# Altium schematic sheet 3_SDRAM_Memories.SchDoc
size A4; Organization: SpaceLab UFSC; Address1: UFSC - SpaceLab; Address2: University Campus - Trindade; Address3: Dep. of Electrical Engineering - CTC; Address4: Florianópolis, Santa Catarina, Brazil; Address5: CEP: 88040 - 900
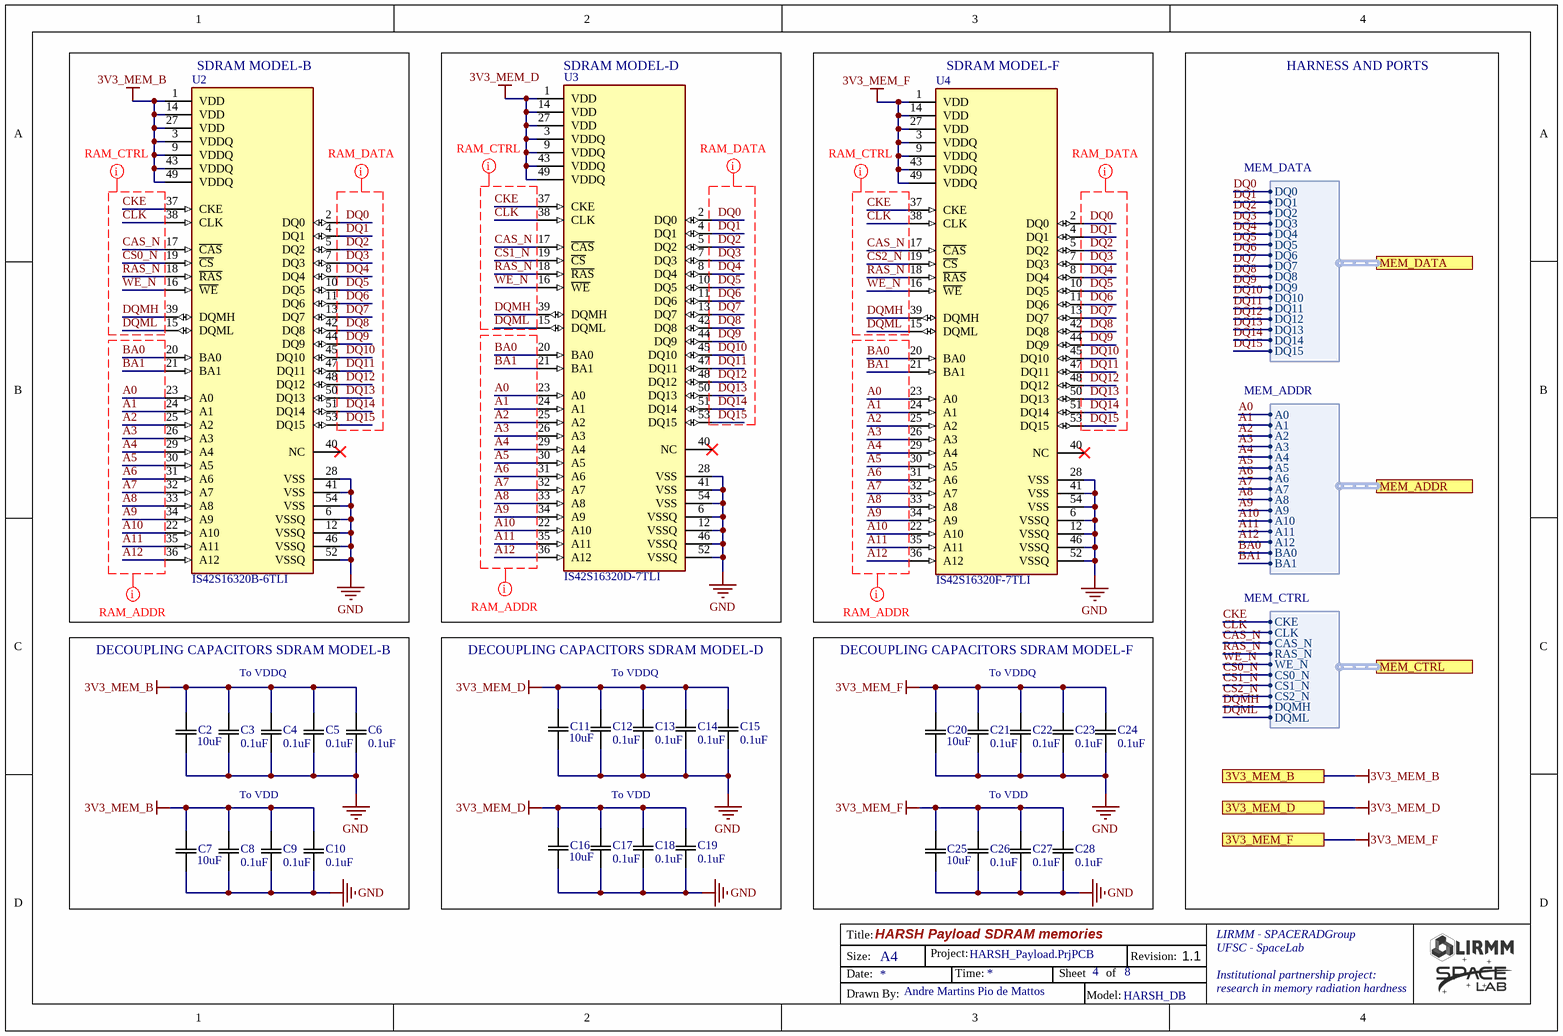
[diagram p0: 3_SDRAM_Memories.SchDoc]

## Parts
C2  10uF  [DONE_C0603]
C3  Capacitance: 0.1uF  [DONE_C0603]  (hidden comment: 100nF/50V)
C4  Capacitance: 0.1uF  [DONE_C0603]  (hidden comment: 100nF/50V)
C5  Capacitance: 0.1uF  [DONE_C0603]  (hidden comment: 100nF/50V)
C6  Capacitance: 0.1uF  [DONE_C0603]  (hidden comment: 100nF/50V)
C7  10uF  [DONE_C0603]
C8  Capacitance: 0.1uF  [DONE_C0603]  (hidden comment: 100nF/50V)
C9  Capacitance: 0.1uF  [DONE_C0603]  (hidden comment: 100nF/50V)
C10  Capacitance: 0.1uF  [DONE_C0603]  (hidden comment: 100nF/50V)
C11  10uF  [DONE_C0603]
C12  Capacitance: 0.1uF  [DONE_C0603]  (hidden comment: 100nF/50V)
C13  Capacitance: 0.1uF  [DONE_C0603]  (hidden comment: 100nF/50V)
C14  Capacitance: 0.1uF  [DONE_C0603]  (hidden comment: 100nF/50V)
C15  Capacitance: 0.1uF  [DONE_C0603]  (hidden comment: 100nF/50V)
C16  10uF  [DONE_C0603]
C17  Capacitance: 0.1uF  [DONE_C0603]  (hidden comment: 100nF/50V)
C18  Capacitance: 0.1uF  [DONE_C0603]  (hidden comment: 100nF/50V)
C19  Capacitance: 0.1uF  [DONE_C0603]  (hidden comment: 100nF/50V)
C20  10uF  [DONE_C0603]
C21  Capacitance: 0.1uF  [DONE_C0603]  (hidden comment: 100nF/50V)
C22  Capacitance: 0.1uF  [DONE_C0603]  (hidden comment: 100nF/50V)
C23  Capacitance: 0.1uF  [DONE_C0603]  (hidden comment: 100nF/50V)
C24  Capacitance: 0.1uF  [DONE_C0603]  (hidden comment: 100nF/50V)
C25  10uF  [DONE_C0603]
C26  Capacitance: 0.1uF  [DONE_C0603]  (hidden comment: 100nF/50V)
C27  Capacitance: 0.1uF  [DONE_C0603]  (hidden comment: 100nF/50V)
C28  Capacitance: 0.1uF  [DONE_C0603]  (hidden comment: 100nF/50V)
U2  IS42S16320B-6TLI  [DONE_ISSI_MEM_TSOP_54]
U3  IS42S16320D-7TLI  [DONE_ISSI_MEM_TSOP_54]
U4  IS42S16320F-7TLI  [DONE_ISSI_MEM_TSOP_54]

## Blocks framed on the sheet
SDRAM MODEL-B: U2
SDRAM MODEL-D: U3
SDRAM MODEL-F: U4
DECOUPLING CAPACITORS SDRAM MODEL-B: C2-C10
DECOUPLING CAPACITORS SDRAM MODEL-D: C11-C19
DECOUPLING CAPACITORS SDRAM MODEL-F: C20-C28

## Ports
3V3_MEM_B, 3V3_MEM_D, 3V3_MEM_F, MEM_ADDR (harness MEM_ADDR), MEM_CTRL (harness MEM_CTRL), MEM_DATA (harness MEM_DATA)

## Harnesses
MEM_DATA: DQ0, DQ1, DQ2, DQ3, DQ4, DQ5, DQ6, DQ7, DQ8, DQ9, DQ10, DQ11, DQ12, DQ13, DQ14, DQ15
MEM_ADDR: A0, A1, A2, A3, A4, A5, A6, A7, A8, A9, A10, A11, A12, BA0, BA1
MEM_CTRL: CKE, CLK, CAS_N, RAS_N, WE_N, CS0_N, CS1_N, CS2_N, DQMH, DQML

## Nets
3V3_MEM_B: C2.1 C3.1 C4.1 C5.1 C6.1 C7.1 C8.1 C9.1 C10.1 U2.1(VDD) U2.3(VDDQ) U2.9(VDDQ) U2.14(VDD) U2.27(VDD) U2.43(VDDQ) U2.49(VDDQ) ; port 3V3_MEM_B
3V3_MEM_D: C11.1 C12.1 C13.1 C14.1 C15.1 C16.1 C17.1 C18.1 C19.1 U3.1(VDD) U3.3(VDDQ) U3.9(VDDQ) U3.14(VDD) U3.27(VDD) U3.43(VDDQ) U3.49(VDDQ) ; port 3V3_MEM_D
3V3_MEM_F: C20.1 C21.1 C22.1 C23.1 C24.1 C25.1 C26.1 C27.1 C28.1 U4.1(VDD) U4.3(VDDQ) U4.9(VDDQ) U4.14(VDD) U4.27(VDD) U4.43(VDDQ) U4.49(VDDQ) ; port 3V3_MEM_F
GND: C2.2 C3.2 C4.2 C5.2 C6.2 C7.2 C8.2 C9.2 C10.2 C11.2 C12.2 C13.2 C14.2 C15.2 C16.2 C17.2 C18.2 C19.2 C20.2 C21.2 C22.2 C23.2 C24.2 C25.2 C26.2 C27.2 C28.2 U2.6(VSSQ) U2.12(VSSQ) U2.28(VSS) U2.41(VSS) U2.46(VSSQ) U2.52(VSSQ) U2.54(VSS) U3.6(VSSQ) U3.12(VSSQ) U3.28(VSS) U3.41(VSS) U3.46(VSSQ) U3.52(VSSQ) U3.54(VSS) U4.6(VSSQ) U4.12(VSSQ) U4.28(VSS) U4.41(VSS) U4.46(VSSQ) U4.52(VSSQ) U4.54(VSS)
A0: U2.23(A0) U3.23(A0) U4.23(A0) ; port MEM_ADDR.A0
A1: U2.24(A1) U3.24(A1) U4.24(A1) ; port MEM_ADDR.A1
A2: U2.25(A2) U3.25(A2) U4.25(A2) ; port MEM_ADDR.A2
A3: U2.26(A3) U3.26(A3) U4.26(A3) ; port MEM_ADDR.A3
A4: U2.29(A4) U3.29(A4) U4.29(A4) ; port MEM_ADDR.A4
A5: U2.30(A5) U3.30(A5) U4.30(A5) ; port MEM_ADDR.A5
A6: U2.31(A6) U3.31(A6) U4.31(A6) ; port MEM_ADDR.A6
A7: U2.32(A7) U3.32(A7) U4.32(A7) ; port MEM_ADDR.A7
A8: U2.33(A8) U3.33(A8) U4.33(A8) ; port MEM_ADDR.A8
A9: U2.34(A9) U3.34(A9) U4.34(A9) ; port MEM_ADDR.A9
A10: U2.22(A10) U3.22(A10) U4.22(A10) ; port MEM_ADDR.A10
A11: U2.35(A11) U3.35(A11) U4.35(A11) ; port MEM_ADDR.A11
A12: U2.36(A12) U3.36(A12) U4.36(A12) ; port MEM_ADDR.A12
BA0: U2.20(BA0) U3.20(BA0) U4.20(BA0) ; port MEM_ADDR.BA0
BA1: U2.21(BA1) U3.21(BA1) U4.21(BA1) ; port MEM_ADDR.BA1
CAS_N: U2.17(~{CAS}) U3.17(~{CAS}) U4.17(~{CAS}) ; port MEM_CTRL.CAS_N
CKE: U2.37(CKE) U3.37(CKE) U4.37(CKE) ; port MEM_CTRL.CKE
CLK: U2.38(CLK) U3.38(CLK) U4.38(CLK) ; port MEM_CTRL.CLK
CS0_N: U2.19(~{CS}) ; port MEM_CTRL.CS0_N
CS1_N: U3.19(~{CS}) ; port MEM_CTRL.CS1_N
CS2_N: U4.19(~{CS}) ; port MEM_CTRL.CS2_N
DQ0: U2.2(DQ0) U3.2(DQ0) U4.2(DQ0) ; port MEM_DATA.DQ0
DQ1: U2.4(DQ1) U3.4(DQ1) U4.4(DQ1) ; port MEM_DATA.DQ1
DQ2: U2.5(DQ2) U3.5(DQ2) U4.5(DQ2) ; port MEM_DATA.DQ2
DQ3: U2.7(DQ3) U3.7(DQ3) U4.7(DQ3) ; port MEM_DATA.DQ3
DQ4: U2.8(DQ4) U3.8(DQ4) U4.8(DQ4) ; port MEM_DATA.DQ4
DQ5: U2.10(DQ5) U3.10(DQ5) U4.10(DQ5) ; port MEM_DATA.DQ5
DQ6: U2.11(DQ6) U3.11(DQ6) U4.11(DQ6) ; port MEM_DATA.DQ6
DQ7: U2.13(DQ7) U3.13(DQ7) U4.13(DQ7) ; port MEM_DATA.DQ7
DQ8: U2.42(DQ8) U3.42(DQ8) U4.42(DQ8) ; port MEM_DATA.DQ8
DQ9: U2.44(DQ9) U3.44(DQ9) U4.44(DQ9) ; port MEM_DATA.DQ9
DQ10: U2.45(DQ10) U3.45(DQ10) U4.45(DQ10) ; port MEM_DATA.DQ10
DQ11: U2.47(DQ11) U3.47(DQ11) U4.47(DQ11) ; port MEM_DATA.DQ11
DQ12: U2.48(DQ12) U3.48(DQ12) U4.48(DQ12) ; port MEM_DATA.DQ12
DQ13: U2.50(DQ13) U3.50(DQ13) U4.50(DQ13) ; port MEM_DATA.DQ13
DQ14: U2.51(DQ14) U3.51(DQ14) U4.51(DQ14) ; port MEM_DATA.DQ14
DQ15: U2.53(DQ15) U3.53(DQ15) U4.53(DQ15) ; port MEM_DATA.DQ15
DQMH: U2.39(DQMH) U3.39(DQMH) U4.39(DQMH) ; port MEM_CTRL.DQMH
DQML: U2.15(DQML) U3.15(DQML) U4.15(DQML) ; port MEM_CTRL.DQML
RAS_N: U2.18(~{RAS}) U3.18(~{RAS}) U4.18(~{RAS}) ; port MEM_CTRL.RAS_N
WE_N: U2.16(~{WE}) U3.16(~{WE}) U4.16(~{WE}) ; port MEM_CTRL.WE_N

Not connected (* = marked no-connect by the designer): U2 40(NC)*; U3 40(NC)*; U4 40(NC)*

## Layout directives
net class RAM_DATA; rule Length Constraint [Min Length = 50mm    Max Length = 60mm]: DQ0, DQ1, DQ2, DQ3, DQ4, DQ5, DQ6, DQ7, DQ8, DQ9, DQ10, DQ11, DQ12, DQ13, DQ14, DQ15
net class RAM_ADDR; rule Length Constraint [Min Length = 50mm    Max Length = 60mm]: A0, A1, A2, A3, A4, A5, A6, A7, A8, A9, A10, A11, A12, BA0, BA1
net class RAM_CTRL; rule Length Constraint [Min Length = 50mm    Max Length = 60mm]: CAS_N, CKE, CLK, CS0_N, DQMH, DQML, RAS_N, WE_N
net class NetClass: A0, A1, A2, A3, A4, A5, A6, A7, A8, A9, A10, A11, A12, BA0, BA1, CAS_N, CKE, CLK, CS1_N, CS2_N, DQ0, DQ1, DQ2, DQ3, DQ4, DQ5, DQ6, DQ7, DQ8, DQ9, DQ10, DQ11, DQ12, DQ13, DQ14, DQ15, DQMH, DQML, RAS_N, WE_N

## Notes on the sheet
- HARNESS AND PORTS
- To VDDQ
- To VDD
- HARSH Payload SDRAM memories
- HARSH_Payload.PrjPCB
- 4
- 8
- 1.1
- Andre Martins Pio de Mattos
- HARSH_DB
- Title:
- Size:
- Date:
- A4
- Project:
- Time:
- Sheet
- of
- Revision:
- LIRMM - SPACERADGroup
- UFSC - SpaceLab
- Institutional partnership project:
- research in memory radiation hardness
- Drawn By:
- Model:

## Library data of the parts
C2 C7 C11 C16 C20 C25 = DONE_CAP_10uF_0603_X5R: CAP CER 10uF 16V 0603 X5R; Partnumber: GRM188R61C106KAALD; Manufacturer: Murata; Tolerance: 10%; NCM: 8532.24.10; Supplier 1: Digi-Key; Manufacturer Part Number: GRM188R61C106KAALD; Stock 1: 0; Pricing 1: 1=0.43, 10=0.302, 100=0.1811, 500=0.1358, 1000=0.1147 (USD); Mount: Surface Mount; Case/Package: 0603; Weight: 0.000222oz; Case Code (Metric): 1608; Case Code (Imperial): 0603; Min Operating Temperature: -55°C; Max Operating Temperature: 85°C; Packaging: Tape and Reel; Voltage Rating: 16V; Dielectric: X5R; Termination: SMD/SMT; Composition: Ceramic; Voltage Rating (DC): 16V; Package Quantity: 4000; Length: 0.063inch; Height: 0.8mm; Width: 0.8mm; Thickness: 0.037inch; REACH SVHC: No SVHC; Lead Free: Lead Free; ComponentLink1URL: http://www.farnell.com/datasheets/2079167.pdf; ComponentLink1Description: http://www.farnell.com/datasheets/2079167.pdf; ComponentLink2URL: http://www.mouser.com/ds/2/281/c02e-2905.pdf; ComponentLink2Description: http://www.mouser.com/ds/2/281/c02e-2905.pdf; ComponentLink3URL: http://search.murata.co.jp/Ceramy/image/img/A01X/partnumbering_e_01.pdf; ComponentLink3Description: http://search.murata.co.jp/Ceramy/image/img/A01X/partnumbering_e_01.pdf; Supplier Part Number 1: 490-10728-1-ND; Capacitance: 10uF
C3-C6 C8-C10 C12-C15 C17-C19 C21-C24 C26-C28 = DONE_CAP_0.1uF_0603_X7R: CAP CER 100nF 50V 0603 10%; Partnumber: C0603C104K5RAC3121; Manufacturer: Yageo; Dielectric: X7R; NCM: 8532.24.10; ComponentLink1Description: https://www.digikey.com/product-detail/en/yageo/CC0201KRX7R9BB101/311-1401-1-ND/2833707; ComponentLink1URL: https://www.digikey.com/product-detail/en/yageo/CC0201KRX7R9BB101/311-1401-1-ND/2833707; ComponentLink2Description: https://br.mouser.com/ProductDetail/Yageo/CC0201KRX7R9BB101?qs=%2Fha2pyFaduiYipKOFrxfqt3%252B9aGSfhofiweIoBBppi5CkwQHqUahpQ%3D%3D; ComponentLink2URL: https://br.mouser.com/ProductDetail/Yageo/CC0201KRX7R9BB101?qs=%2Fha2pyFaduiYipKOFrxfqt3%252B9aGSfhofiweIoBBppi5CkwQHqUahpQ%3D%3D; Supplier 1: Digi-Key; Supplier Part Number 1: 311-1401-1-ND; Stock 1: 203642; Pricing 1: 1=0.1, 10=0.017, 100=0.0078, 500=0.00554, 1000=0.00436, 2500=0.00396, 5000=0.00364 (USD); Mount: Surface Mount; Case/Package: 0201; Weight: 6E-06oz; Case Code (Metric): 0603; Case Code (Imperial): 0201; Min Operating Temperature: -55°C; Max Operating Temperature: 125°C; Tolerance: 10%; Package Quantity: 1; Voltage Rating: 50V; Packaging: Tape and Reel; Voltage Rating (DC): 50V; Termination: SMD/SMT; Composition: Ceramic; Length: 0.6mm; Height: 0.3mm; Width: 0.012inch; Thickness: 0.013inch; Depth: 0.3mm; Radiation Hardening: No; Lead Free: Lead Free; Halogen Free: Halogen Free; ComponentLink3URL: http://www.yageo.com/documents/recent/UPY-GPHC_X7R_6.3V-to-50V_18.pdf?src-supplier=Digi-Key; ComponentLink3Description: http://www.yageo.com/documents/recent/UPY-GPHC_X7R_6.3V-to-50V_18.pdf?src-supplier=Digi-Key; ComponentLink4URL: http://www.yageo.com/documents/recent/UPY-GPHC_X7R_6.3V-to-50V_8.pdf?src-supplier=Avnet+Europe; ComponentLink4Description: http://www.yageo.com/documents/recent/UPY-GPHC_X7R_6.3V-to-50V_8.pdf?src-supplier=Avnet+Europe; ComponentLink5URL: http://www.yageo.com/documents/recent/UPY-GPHC_X7R_6.3V-to-50V_8.pdf?src-supplier=Avnet; ComponentLink5Description: http://www.yageo.com/documents/recent/UPY-GPHC_X7R_6.3V-to-50V_8.pdf?src-supplier=Avnet; ComponentLink6URL: http://www.mouser.com/ds/2/447/Yageo_UPY-GP_NP0_16V-to-50V_9-358835.pdf?src-supplier=Mouser; ComponentLink6Description: http://www.mouser.com/ds/2/447/Yageo_UPY-GP_NP0_16V-to-50V_9-358835.pdf?src-supplier=Mouser; Supplier 2: Mouser; Supplier Part Number 2: 603-CC201KRX7R9BB101; Stock 2: 51204; Pricing 2: 1=0.1, 10=0.024, 100=0.011, 1000=0.009, 2500=0.006, 10000=0.006 (USD)
U2 = DONE_ISSI_MEM_MODEL_B: DRAM 512M, 3.3V, SDRAM, 32Mx16, 143MHz, 54 pin TSOP II; Partnumber: IS42S16320B-6TLI
U3 = DONE_ISSI_MEM_MODEL_D: DRAM 512M, 3.3V, SDRAM, 32Mx16, 143MHz, 54 pin TSOP II; Partnumber: IS42S16320D-7TLI
U4 = DONE_ISSI_MEM_MODEL_F: DRAM 512M, 3.3V, SDRAM, 32Mx16, 143MHz, 54 pin TSOP II; Partnumber: IS42S16320F-7TLI